# EAGLE design BippetyBoop (EAGLE 5.11)
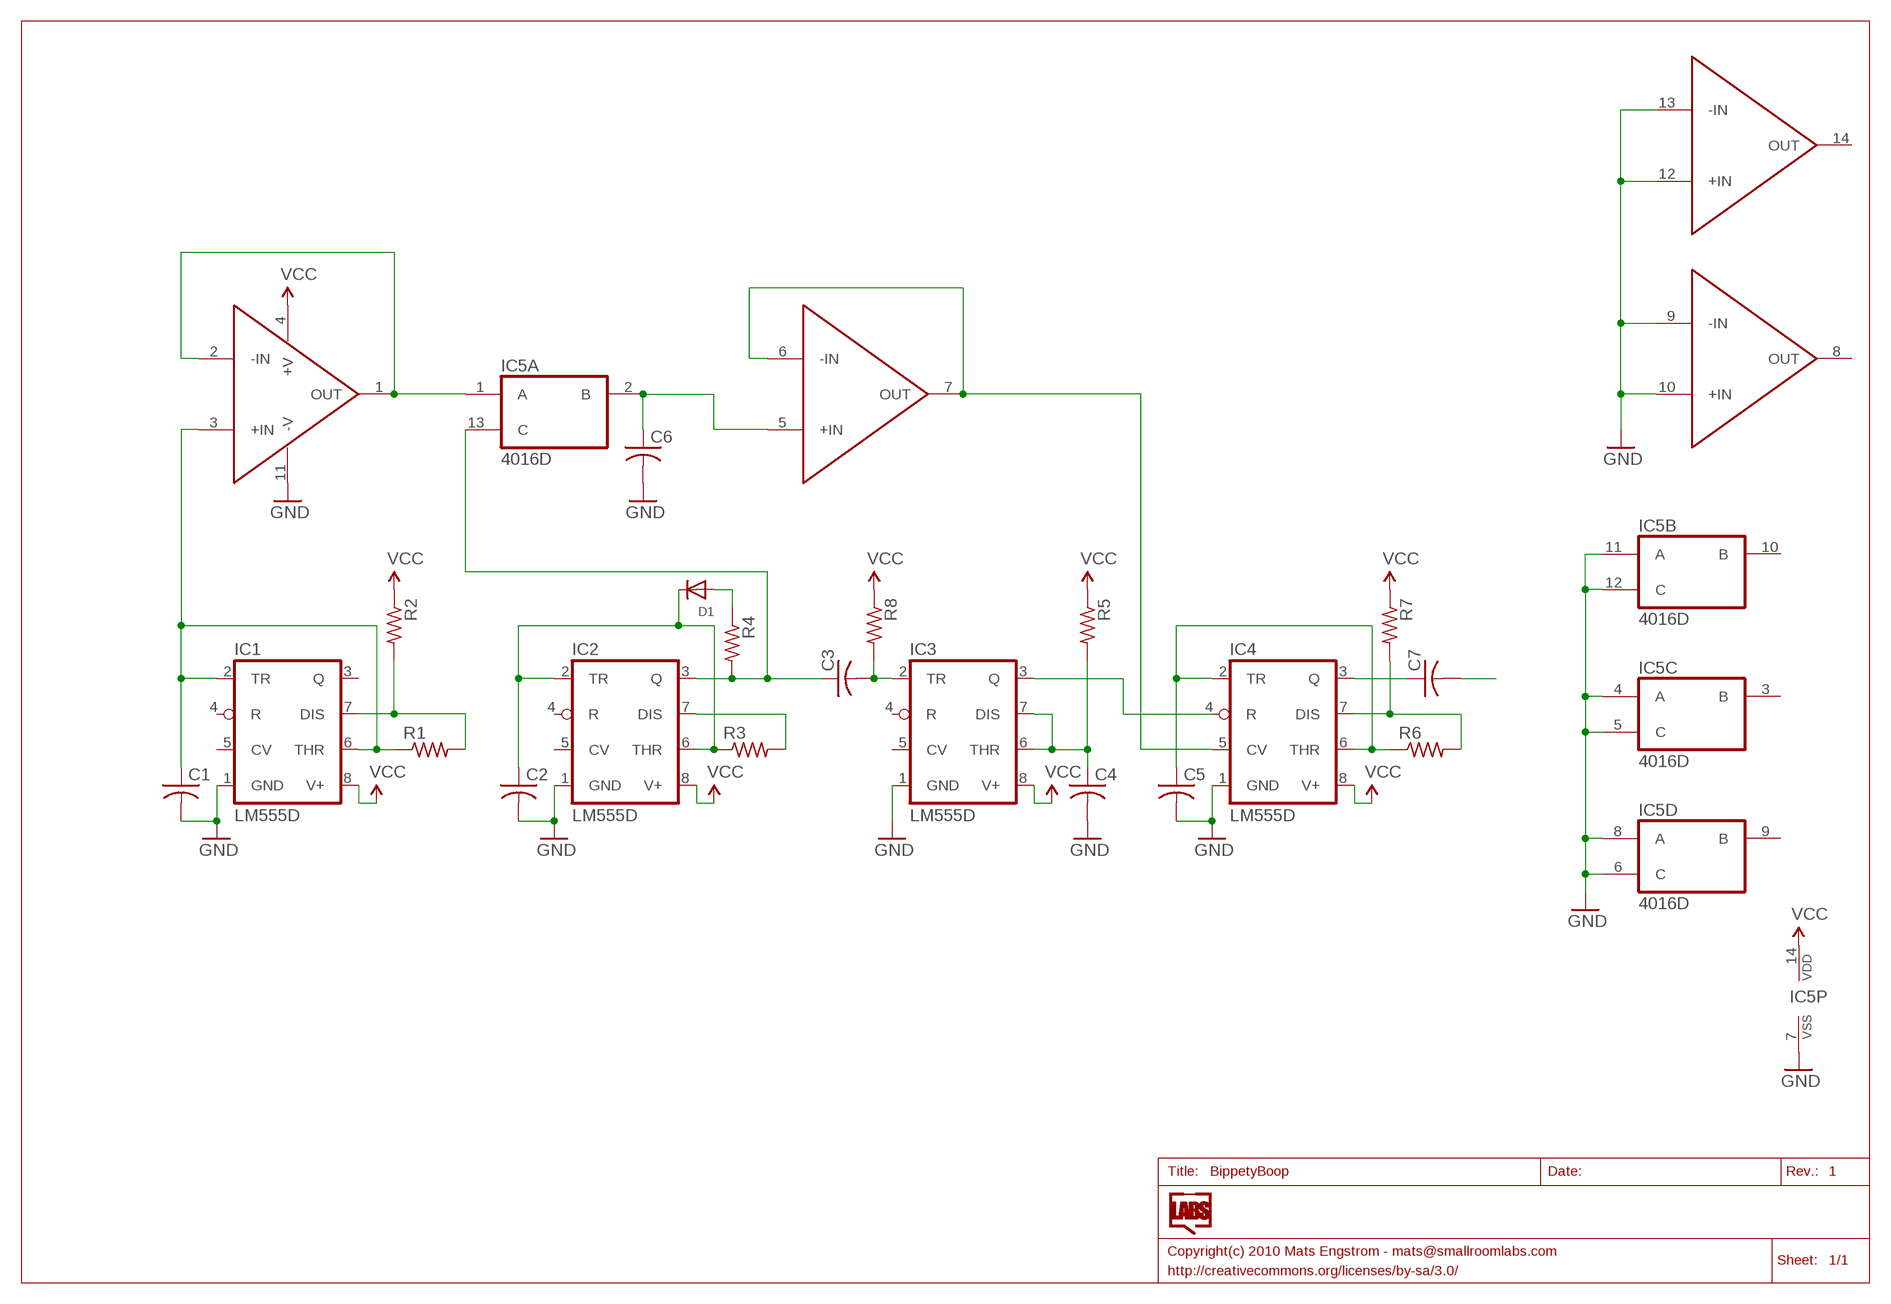
[diagram p0: schematic, sheet 1]

## Parts
C1  C-USC1206  [C1206]
C2  C-USC1206  [C1206]
C3  C-USC1206  [C1206]
C4  C-USC1206  [C1206]
C5  C-USC1206  [C1206]
C6  C-USC1206  [C1206]
C7  C-USC1206  [C1206]
D1  DIODESMA  [SMADIODE]
IC1  LM555D  [SO08]
IC2  LM555D  [SO08]
IC3  LM555D  [SO08]
IC4  LM555D  [SO08]
IC5  4016D  [SO14]
R1  R-US_R0805W  [R0805W]
R2  R-US_R0805W  [R0805W]
R3  R-US_R0805W  [R0805W]
R4  R-US_R0805W  [R0805W]
R5  R-US_R0805W  [R0805W]
R6  R-US_R0805W  [R0805W]
R7  R-US_R0805W  [R0805W]
R8  R-US_R0805W  [R0805W]
U$2  LMV324  [SO014]

## Nets
GND: C1.2 C2.2 C4.2 C5.2 C6.2 IC1.1(GND) IC2.1(GND) IC3.1(GND) IC4.1(GND) IC5.4(C:A) IC5.5(C:C) IC5.6(D:C) IC5.7(P:VSS) IC5.8(D:A) IC5.11(B:A) IC5.12(B:C) U$2.9(-IN) U$2.10(+IN) U$2.11(-V) U$2.12(+IN) U$2.13(-IN)
N$1: IC5.1(A:A) U$2.1(OUT) U$2.2(-IN)
N$2: IC4.7(DIS) R6.2 R7.2
N$3: C7.2
N$4: C4.1 IC3.6(THR) IC3.7(DIS) R5.2
N$5: IC3.3(Q) IC4.4(R)
N$6: C7.1 IC4.3(Q)
N$7: C5.1 IC4.2(TR) IC4.6(THR) R6.1
N$8: C3.2 IC3.2(TR) R8.2
N$9: C3.1 IC2.3(Q) IC5.13(A:C) R4.2
N$10: C2.1 D1.C IC2.2(TR) IC2.6(THR) R3.1
N$11: IC2.7(DIS) R3.2
N$12: D1.A R4.1
N$14: IC1.7(DIS) R1.2 R2.2
N$15: IC4.5(CV) U$2.6(-IN) U$2.7(OUT)
N$16: C1.1 IC1.2(TR) IC1.6(THR) R1.1 U$2.3(+IN)
N$17: C6.1 IC5.2(A:B) U$2.5(+IN)
VCC: IC1.8(V+) IC2.8(V+) IC3.8(V+) IC4.8(V+) IC5.14(P:VDD) R2.1 R5.1 R7.1 R8.1 U$2.4(+V)
Unconnected: IC1.3(Q) IC1.4(R) IC1.5(CV) IC2.4(R) IC2.5(CV) IC3.4(R) IC3.5(CV) IC5.3(C:B) IC5.9(D:B) IC5.10(B:B)

## Power pins joined to a net without a drawn wire
OUT: U$2.8(OUT) U$2.14(OUT)

## Library data of the parts
C1-C7 = adafruit:C-US: CAPACITOR, American symbol
D1 = adafruit:DIODE: Diode SMADIODE - SMA Surface Mount Package 20V 1A Schottky Diode Digikey: 641-1014-6-ND DO-1N4148 - Through Hole Small Current Diode SOD-123 20V 1 A (.5mV Vf) Schottky Diode - Digikey: MBRX120TPMSCT-ND SOD-323 10V 570mA (.38mV Vf, 3ns) Schottky Diode - Digikey: ZLLS410CT-ND SOD-523 30V 30mA Schottky Diode (RB751S-40TE61) - Digikey: RB751S-40TE61CT-ND SOT23-R/W - SOT23 Package (R = Solder Paste/Reflow Ovens, W = Hand-Soldering) BAT54Film 40V 300mA - Digikey: 497-7162-1-ND
IC1-IC4 = adafruit:*555: TIMER Changed DIP package to have round (not oval) pin pads http://www.ladyada.net/library/pcb/eaglelibrary.html
IC5 = 40xx:4016: Quad bilateral ANALOG SWITCH
R1-R8 = adafruit:R-US_: RESISTOR, American symbol
U$2 = SparkFun:LMV324

## Board
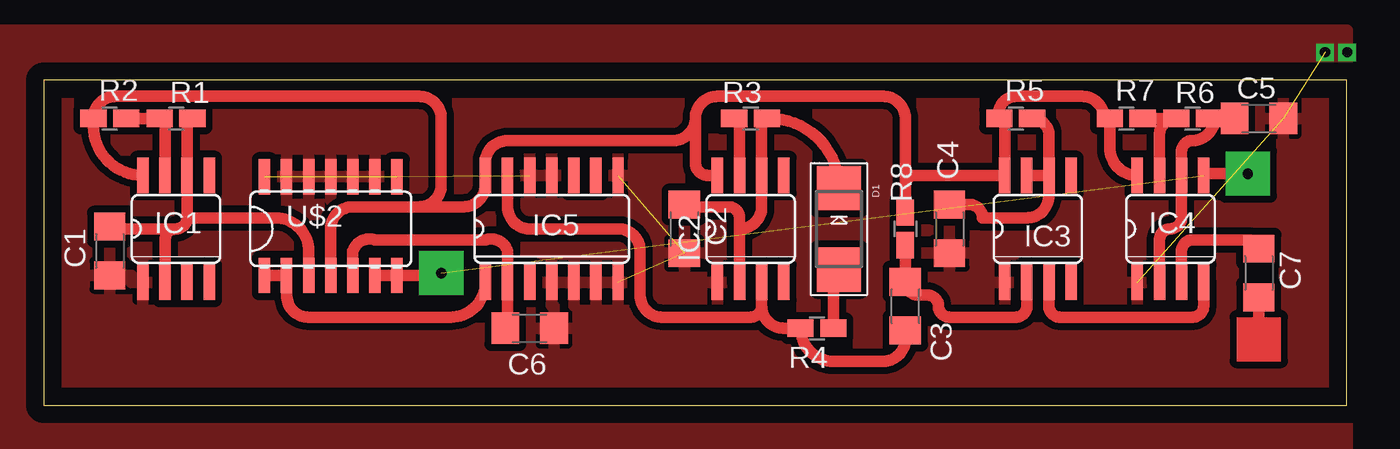
[diagram p1: board, top side]

Size 74.91 x 18.72 mm. Coordinates in mm from the lower left corner, seen from the top.
Outline: 0,0 74.91,0 74.91,18.72 0,18.72 0,0
Copper layers (1*16): Top 0.035mm / dielectric 1.5mm / Bottom 0.035mm
Design rules "default": minimum track width 10mil, minimum drill 0.6mm, track to track 8mil, track to pad 8mil, pad to pad 8mil, via to via 8mil, smd to smd 8mil, copper to edge 40mil, drill to drill 8mil, minimum pad ring 10mil, minimum via ring 8mil, stop-mask expansion 4mil, vias tented up to drill 0mil, thermal gap 10mil

### Footprints (pad centres in the part's own frame; a part is rotated, then mirrored left to right if it is on the bottom)
C1206 = smd 1.6 x 1.8: 1 -1.4,0; 2 1.4,0
SMADIODE = smd 2.54 x 2.54: A 2.349,0; C -2.349,0
SO08 = smd 0.66 x 2.032: 1 -1.905,-3.073; 2 -0.635,-3.073; 3 0.635,-3.073; 4 1.905,-3.073; 5 1.905,3.073; 6 0.635,3.073; 7 -0.635,3.073; 8 -1.905,3.073
SO14 = smd 0.66 x 2.032: 1 -3.81,-3.073; 2 -2.54,-3.073; 3 -1.27,-3.073; 4 0,-3.073; 5 1.27,-3.073; 6 2.54,-3.073; 7 3.81,-3.073; 8 3.81,3.073; 9 2.54,3.073; 10 1.27,3.073; 11 0,3.073; 12 -1.27,3.073; 13 -2.54,3.073; 14 -3.81,3.073
R0805W = smd 1.5 x 1: 1 -0.94,0; 2 0.94,0
SO014 = smd 0.66 x 2.032: 1 -3.175,-2.68; 2 -1.905,-2.68; 3 -0.635,-2.68; 4 0.635,-2.68; 5 1.905,-2.68; 6 3.175,-2.68; 7 4.445,-2.68; 8 4.445,2.997; 9 3.175,2.997; 10 1.905,2.997; 11 0.635,2.997; 12 -0.635,2.997; 13 -1.905,2.997; 14 -3.175,2.997

### Placement (x,y rotation side)
C1  3.81,8.89 270 top
C2  36.83,10.16 270 top
C3  49.53,5.71 90 top
C4  52.07,10.16 270 top
C5  69.85,16.51 0 top
C6  27.94,4.45 0 top
C7  69.85,7.62 270 top
D1  45.72,10.16 270 top
IC1  7.62,10.16 0 top
IC2  40.64,10.16 0 top
IC3  57.15,10.16 0 top
IC4  64.77,10.16 0 top
IC5  29.21,10.16 0 top
R1  7.62,16.51 180 top
R2  3.81,16.51 0 top
R3  40.64,16.51 180 top
R4  44.45,4.45 180 top
R5  55.88,16.51 0 top
R6  66.04,16.51 180 top
R7  62.23,16.51 0 top
R8  49.53,10.16 270 top
U$2  15.88,10.16 0 top

### Tracks (layer width: path | path; a pad name or v marks a point on that pad's centre or on a via)
GND  (via drill 0.6)  (5 unrouted)
  other vias: 73.66,20.32 74.93,20.32
  pour Top (isolate 0.406): -2.54,21.59 74.93,21.59 74.93,-2.54 -2.54,-2.54
N$1
  Top 0.66: U$2.1 U$2.2 13.97,6.35 arc90 15.24,5.08 22.86,5.08 23.39,5.08 arc90 IC5.1
N$2
  Top 0.66: IC4.7 64.14,15.54 arc-90 R6.2 R7.2
N$4
  Top 0.66: IC3.6 57.78,12.06 arc-90 56.52,10.79 53.98,10.79 arc90 53.21,11.56 C4.1 | IC3.6 57.78,15.54 arc90 R5.2 | IC3.6 IC3.7
N$5
  Top 0.66: IC3.3 57.78,5.71 arc90 58.42,5.08 66.04,5.08 arc90 66.67,5.71 IC4.4
N$6
  Top 0.66: IC4.3 65.41,8.89 arc-90 66.04,9.53 69.34,9.53 arc90 C7.1
N$7
  Top 0.66: IC4.2 64.14,9.53 arc-90 64.77,10.16 arc90 65.41,10.79 IC4.6 65.41,14.61 arc-90 66.04,15.24 arc90 67.31,16.51 | 67.31,16.51 R6.1 | 67.31,16.51 C5.1
N$8
  Top 0.66: R8.2 C3.2 arc90 50.3,6.35 50.8,6.35 arc-90 51.44,5.71 arc90 52.07,5.08 55.88,5.08 arc90 56.52,5.71 IC3.2
N$9
  Top 0.66: 41.27,5.71 IC2.3 | 41.27,5.71 arc90 42.55,4.45 R4.2 arc90 45.41,2.54 45.72,2.54 48.26,2.54 arc90 49.53,3.81 C3.1 | IC5.13 26.67,11.43 arc90 27.94,10.16 33.02,10.16 arc-90 34.29,8.89 34.29,7.62 34.29,6.35 arc90 35.56,5.08 40.64,5.08 arc90 41.27,5.71
N$10
  Top 0.66: IC2.2 40.01,10.16 | 40.01,10.16 40.01,10.79 arc90 39.37,11.43 36.96,11.43 arc-90 C2.1 | 40.01,10.16 arc90 41.27,11.43 IC2.6 41.27,16.51 R3.1 41.72,16.51 arc-90 D1.C
N$11
  Top 0.66: R3.2 40.01,16.2 IC2.7
N$12
  Top 0.66: D1.A 45.39,7.48 R4.1
N$13
  Top 0.66: 69.85,3.81 69.85,6.35
N$14
  Top 0.66: IC1.7 6.99,16.2 arc90 R1.2 R2.2
N$15  (via drill 0.6 pad 2.54)  (1 unrouted)
  Top 0.66: U$2.6 U$2.7 22.72,7.48 arc90 v22.86,7.62 | v69.22,13.34 66.78,13.34 arc90 IC4.5
N$16
  Top 0.66: R1.1 arc90 8.26,16.2 IC1.6 8.26,10.79 | 7.62,10.16 arc90 8.26,10.79 | 7.62,10.16 3.94,10.16 arc-90 C1.1 | IC1.2 6.99,9.53 arc-90 7.62,10.16 | 8.26,10.79 13.34,10.79 arc-90 15.24,8.89 U$2.3
N$17
  Top 0.66: U$2.5 17.78,8.89 arc-90 19.05,9.53 25.4,9.53 arc-90 26.67,8.89 IC5.2 26.67,4.58 arc-90 C6.1
OUT  (1 unrouted)
VCC
  Top 0.66: 49.53,12.7 arc-90 50.06,13.23 IC3.8 55.24,16.2 arc90 R5.1 arc-107 55.88,17.78 59.69,17.78 arc-90 60.96,16.51 R7.1 61.29,14.81 arc90 IC4.8 | 49.53,12.7 R8.1 | IC2.8 38.2,13.23 arc-90 37.47,13.97 37.47,16.51 | 37.47,16.51 arc-90 38.73,17.78 48.26,17.78 arc-90 49.53,16.51 49.53,12.7 | 16.51,10.16 U$2.4 | 17.78,11.43 arc90 16.51,10.16 | 17.78,11.43 24.13,11.43 arc90 25.4,12.7 IC5.14 25.4,13.97 arc-90 26.67,15.24 36.2,15.24 arc90 37.47,16.51 | IC1.8 arc-90 2.87,16.08 R2.1 arc-90 4.14,17.78 21.59,17.78 arc-90 22.86,16.51 22.86,12.7 arc-90 21.59,11.43 17.78,11.43 | 17.78,11.43 arc90 16.51,10.16
(copper drawn outside any net)
  shapes: Top area x1